# Altium schematic sheet Power.SchDoc
size A
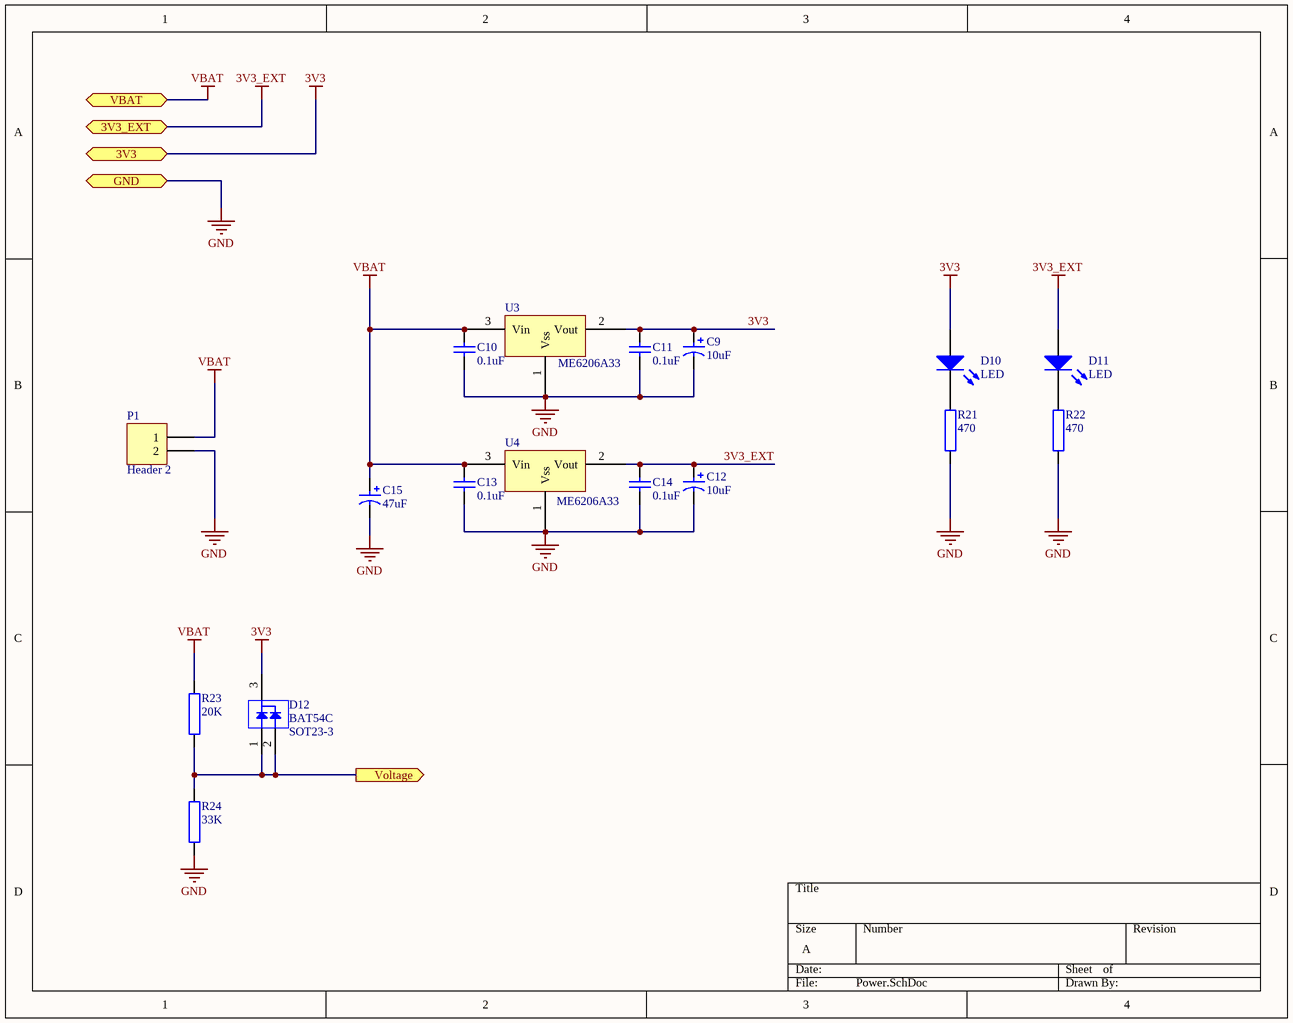
[diagram p0: Power.SchDoc]

## Parts
C9  10uF  [Cap_Ta_A_Case]
C10  0.1uF  [C0603]
C11  0.1uF  [C0603]
C12  10uF  [Cap_Ta_A_Case]
C13  0.1uF  [C0603]
C14  0.1uF  [C0603]
C15  47uF  [Cap_Ta_B_Case]
D10  LED  [LED_0603]
D11  LED  [LED_0603]
D12  BAT54C  [SOT23-3]
P1  Header 2  [HDR1X2]
R21  470  [R0603]
R22  470  [R0603]
R23  20K  [r0603]
R24  33K  [r0603]
U3  ME6206A33  [SOT23-3]
U4  ME6206A33  [SOT23-3]

## Ports
3V3, 3V3_EXT, GND, VBAT, Voltage (out)

## Nets
3V3: C9.1 C11.1 D10.1(A) D12.3 U3.2(Vout) ; port 3V3
3V3_EXT: C12.1 C14.1 D11.1(A) U4.2(Vout) ; port 3V3_EXT
GND: C9.2 C10.2 C11.2 C12.2 C13.2 C14.2 C15.2 P1.2 R21.1 R22.1 R24.1 U3.1(Vss) U4.1(Vss) ; port GND
VBAT: C10.1 C13.1 C15.1 P1.1 R23.2 U3.3(Vin) U4.3(Vin) ; port VBAT
Voltage: D12.1 D12.2 R23.1 R24.2 ; port Voltage
NetD10_2: D10.2(K) R21.2
NetD11_2: D11.2(K) R22.2

## Library data of the parts
C9 C12 C15 = Cap Tantalum: Polarized Capacitor (Surface Mount); Published: 8-Jun-2000; LatestRevisionDate: 29-May-2009; LatestRevisionNote: IPC-7351 Footprint Added.; PackageReference: Cap_Ta_A_Case; Publisher: Altium Limited; PackageDescription: Chip Capacitor
  C9 C12: Value: 10uF
  C15: Value: 47uF
C10 C11 C13 C14 = Cap: Capacitor (Semiconductor SIM Model); Published: 8-Jun-2000; LatestRevisionDate: 29-May-2009; LatestRevisionNote: IPC-7351 Footprint Added.; PackageReference: C0603; Publisher: Altium Limited; PackageDescription: Chip Capacitor; Value: 0.1uF
D10 D11 = LED: Typical INFRARED GaAs LED; Published: 8-Jun-2000; LatestRevisionDate: 08-Jul-2005; LatestRevisionNote: Mech Layer 1 removed.; PackageReference: LED-0; Publisher: Altium Limited; PackageDescription: LED; 2 Leads
P1 = Header 2: Header, 2-Pin; LatestRevisionDate: 17-Jul-2002; LatestRevisionNote: Re-released for DXP Platform.; Publisher: Altium Limited
R21-R24 = Res3: Resistor; Published: 8-Jun-2000; LatestRevisionDate: 29-May-2009; LatestRevisionNote: IPC-7351 Footprint Added.; PackageReference: R0603; Publisher: Altium Limited; PackageDescription: Chip Resistor
  R21 R22: Value: 470
  R23: Value: 20K
  R24: Value: 33K
U3 U4 = ME6206: ME6206A33, SOT23